# Altium schematic sheet EDVDU_v1.SchDoc
size A0
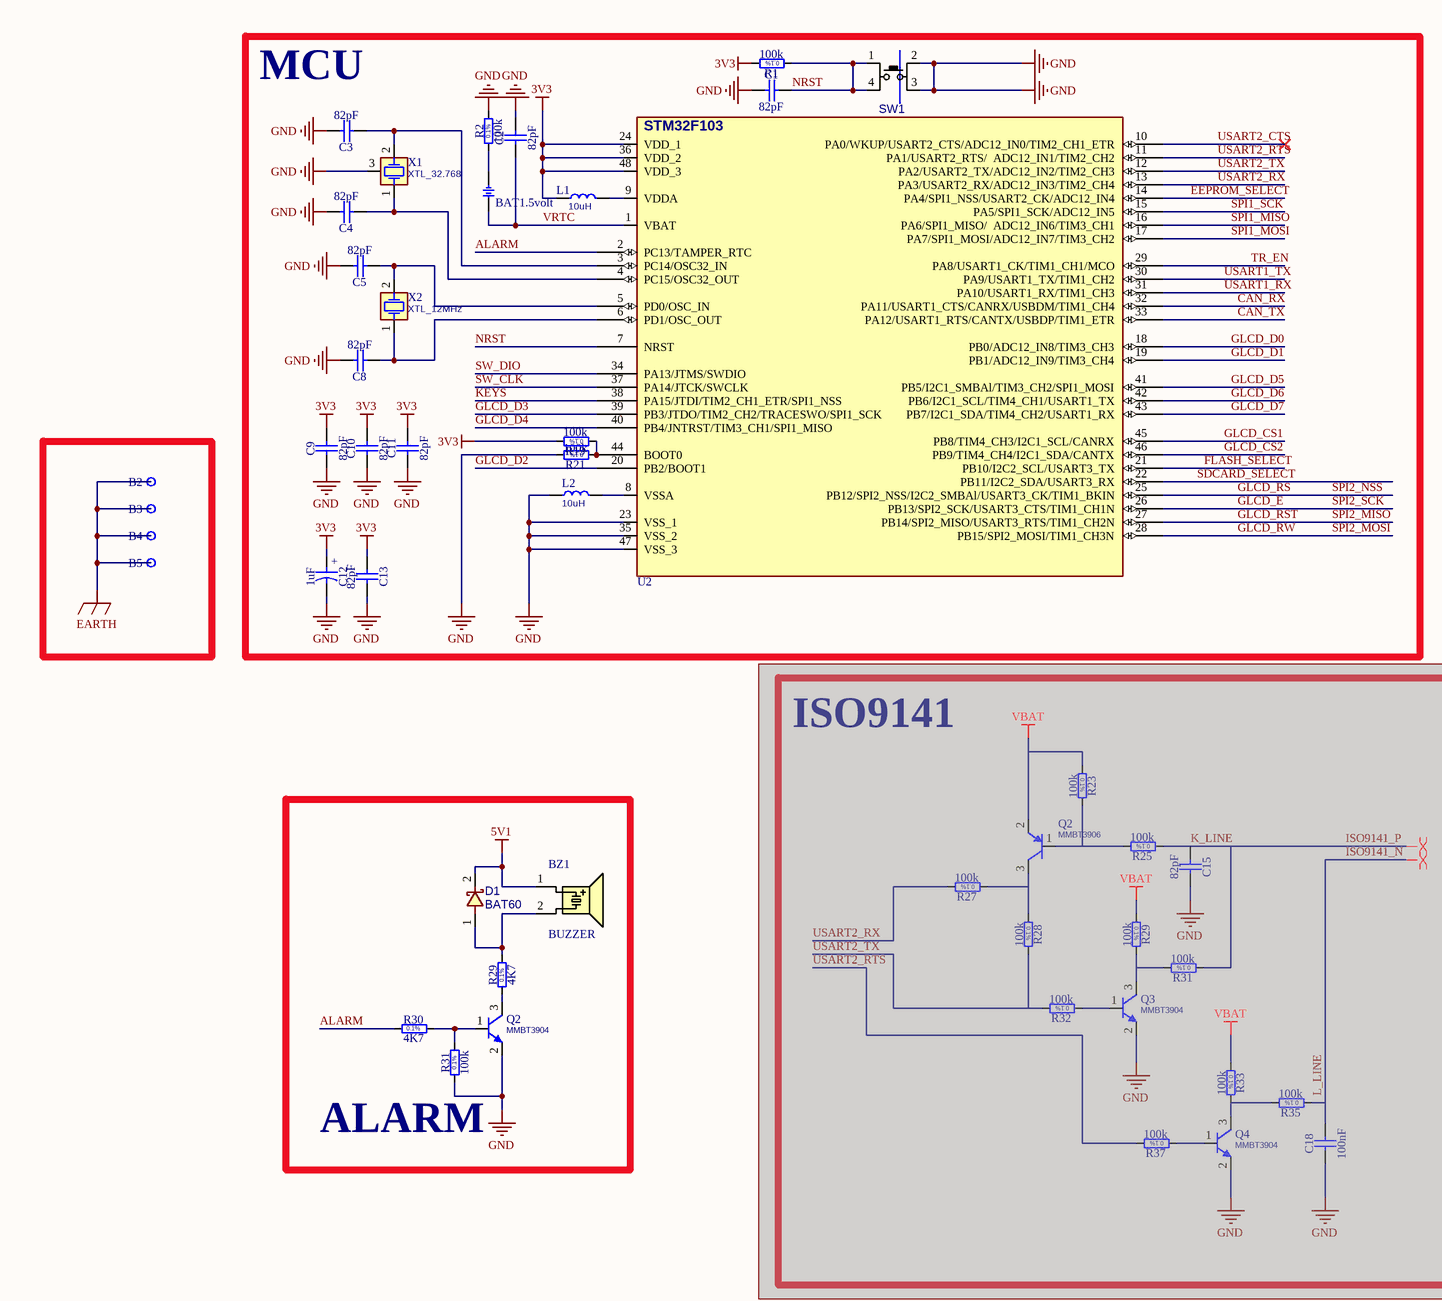
[diagram p0: EDVDU_v1.SchDoc, top left]
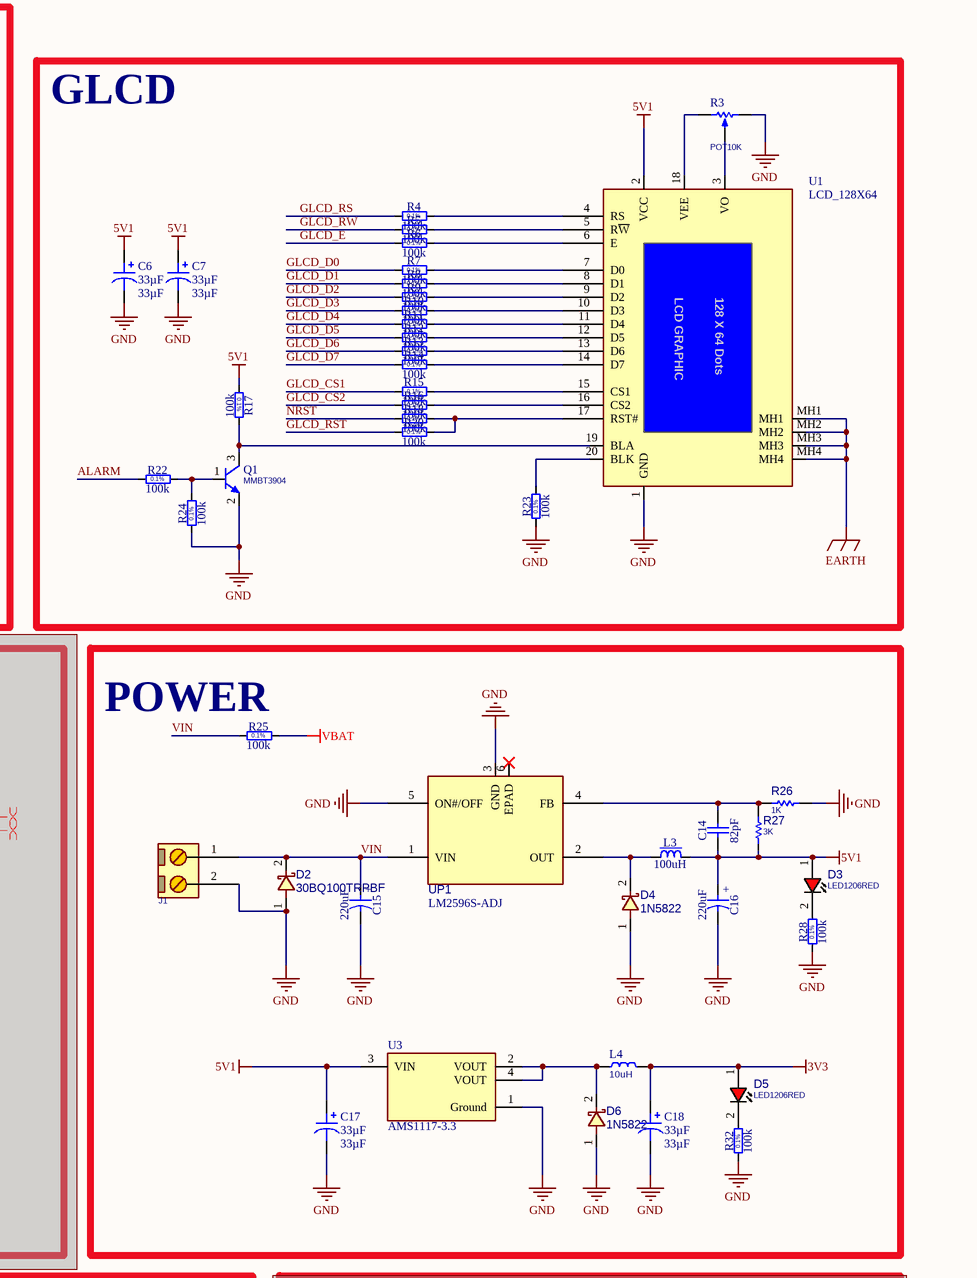
[diagram p1: EDVDU_v1.SchDoc, top right]
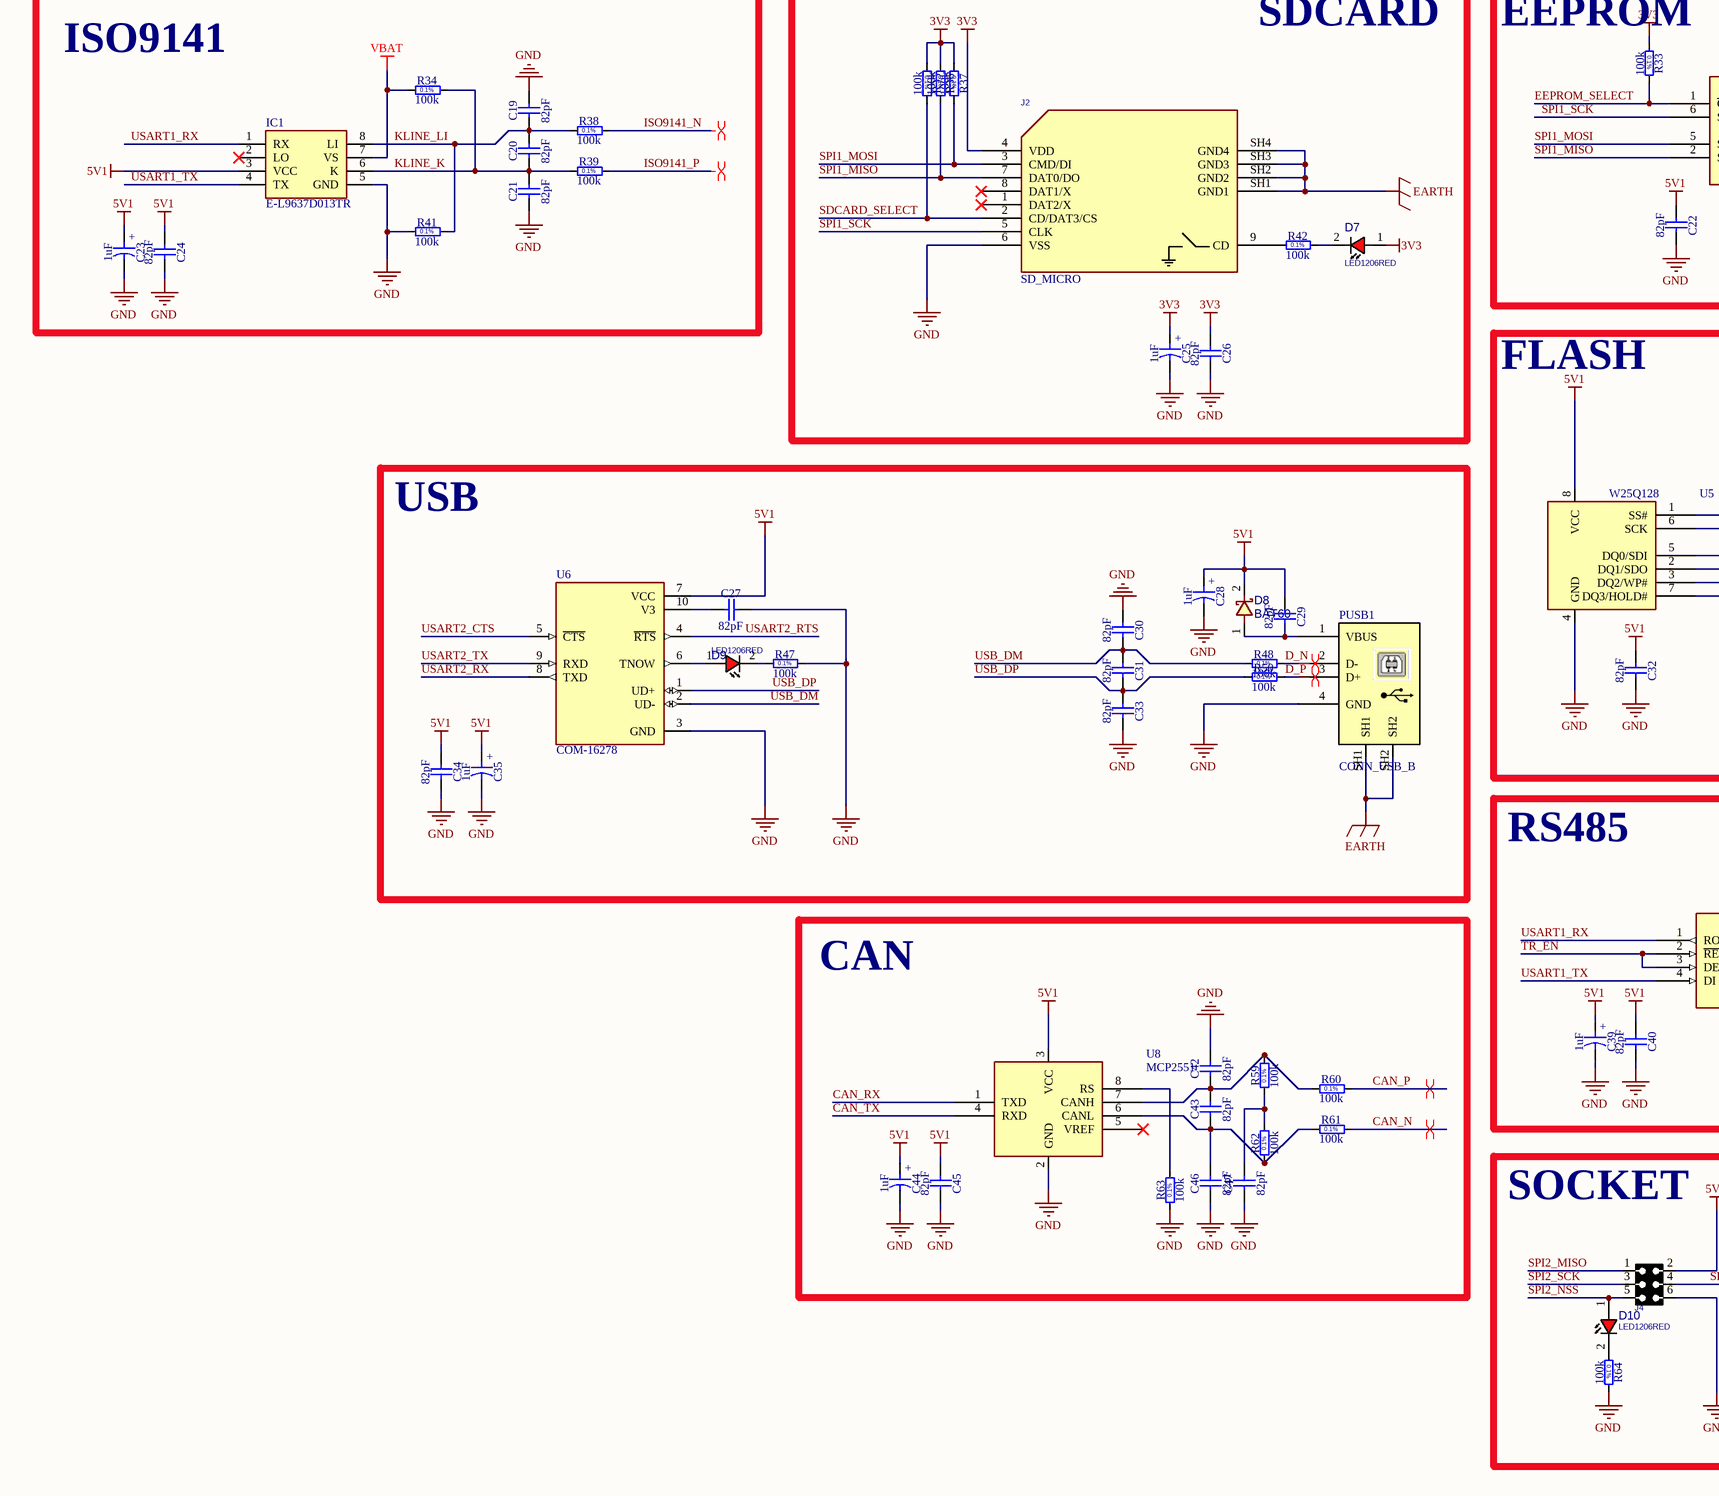
[diagram p2: EDVDU_v1.SchDoc, bottom left]
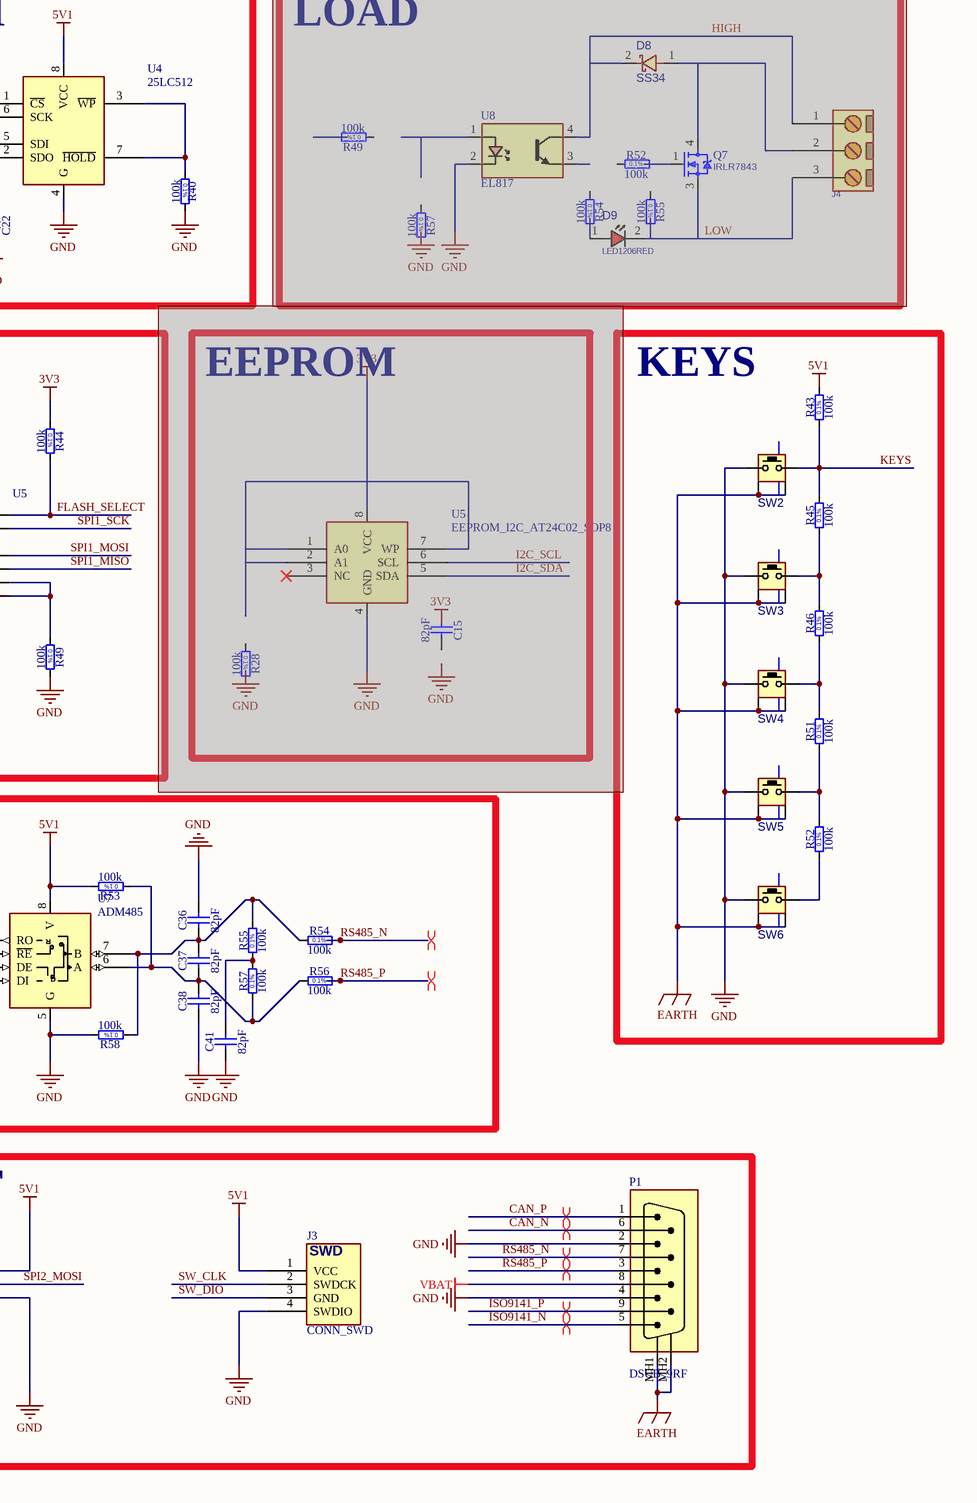
[diagram p3: EDVDU_v1.SchDoc, bottom right]

## Parts
(Parts that share a designator on the sheet are numbered #1, #2 ... from top to bottom, then left to right.)
B1  BAT1.5volt  [BT_TS518FE_FL35E]
B2  Plated Hole  [MTG320_550]  (value not drawn)  (no BOM)
B3  Plated Hole  [MTG320_550]  (value not drawn)  (no BOM)
B4  Plated Hole  [MTG320_550]  (value not drawn)  (no BOM)
B5  Plated Hole  [MTG320_550]  (value not drawn)  (no BOM)
BZ1  BUZZER  [BZ_C12]
C1  82pF  [CAPC3216X140N]
C2  82pF  [CAPC3216X140N]
C3  82pF  [CAPC3216X140N]
C4  82pF  [CAPC3216X140N]
C5  82pF  [CAPC3216X140N]
C6  33µF  [CAP POL 1206_3216]
C7  33µF  [CAP POL 1206_3216]
C8  82pF  [CAPC3216X140N]
C9  82pF  [CAPC3216X140N]
C10  82pF  [CAPC3216X140N]
C11  82pF  [CAPC3216X140N]
C12  1uF  [CAPMP3216X180N]
C13  82pF  [CAPC3216X140N]
C14  82pF  [CAPC3216X140N]
C15#1  82pF  [CAPC3216X140N]  (masked out: inside a compile mask, not in the netlist)
C15#2  220uF  [CAPMP7343X430N]
C15#3  82pF  [CAPC3216X140N]  (masked out: inside a compile mask, not in the netlist)
C16  220uF  [CAPMP7343X430N]
C17  33µF  [CAP POL 1206_3216]
C18#1  33µF  [CAP POL 1206_3216]
C18#2  100nF  [CAPC3216X180N]  (masked out: inside a compile mask, not in the netlist)
C19  82pF  [CAPC3216X140N]
C20  82pF  [CAPC3216X140N]
C21  82pF  [CAPC3216X140N]
C22  82pF  [CAPC3216X140N]
C23  1uF  [CAPMP3216X180N]
C24  82pF  [CAPC3216X140N]
C25  1uF  [CAPMP3216X180N]
C26  82pF  [CAPC3216X140N]
C27  82pF  [CAPC3216X140N]
C28  1uF  [CAPMP3216X180N]
C29  82pF  [CAPC3216X140N]
C30  82pF  [CAPC3216X140N]
C31  82pF  [CAPC3216X140N]
C32  82pF  [CAPC3216X140N]
C33  82pF  [CAPC3216X140N]
C34  82pF  [CAPC3216X140N]
C35  1uF  [CAPMP3216X180N]
C36  82pF  [CAPC3216X140N]
C37  82pF  [CAPC3216X140N]
C38  82pF  [CAPC3216X140N]
C39  1uF  [CAPMP3216X180N]
C40  82pF  [CAPC3216X140N]
C41  82pF  [CAPC3216X140N]
C42  82pF  [CAPC3216X140N]
C43  82pF  [CAPC3216X140N]
C44  1uF  [CAPMP3216X180N]
C45  82pF  [CAPC3216X140N]
C46  82pF  [CAPC3216X140N]
C47  82pF  [CAPC3216X140N]
D1  BAT60  [D_SOD323F]
D2  30BQ100TRPBF  [D_SMC]
D3  LED1206RED  [LED1206RED]
D4  1N5822  [D_SMA]
D5  LED1206RED  [LED1206RED]
D6  1N5822  [D_SMA]
D7  LED1206RED  [LED1206RED]
D8#1  SS34  [D_SMB]  (masked out: inside a compile mask, not in the netlist)
D8#2  BAT60  [D_SOD323F]
D9#1  LED1206RED  [LED1206RED]  (masked out: inside a compile mask, not in the netlist)
D9#2  LED1206RED  [LED1206RED]
D10  LED1206RED  [LED1206RED]
IC1  E-L9637D013TR  [SOIC127P600X175-8N]
J1  POWER  [MSTB_2]  (value not drawn)
J2  value SD_MICRO  [SDMICRO_AT]  (hidden comment: MICROSD)
J3  value CONN_SWD  [WF_4]  (hidden comment: PROG)
J4#1  CONN_MSTB3  [MSTB_3]  (value not drawn)  (masked out: inside a compile mask, not in the netlist)
J4#2  SERIAL  [HDRR_F_2X3]  (value not drawn)
L1  10uH  [L1206]
L2  10uH  [L1206]
L3  100uH  [IND_WURTH_WE-PD_XXL]
L4  10uH  [L1206]
P1  value DSUB_9RF  [DSUB_9RF]  (hidden comment: COMM)
PUSB1  value CONN_USB_B  [USB_B_RA_THD]  (hidden comment: USB)
Q1  MMBT3904  [SOT23_3]
Q2#1  MMBT3906  [SOT23_3]  (masked out: inside a compile mask, not in the netlist)
Q2#2  MMBT3904  [SOT23_3]
Q3  MMBT3904  [SOT23_3]  (masked out: inside a compile mask, not in the netlist)
Q4  MMBT3904  [SOT23_3]  (masked out: inside a compile mask, not in the netlist)
Q7  IRLR7843  [DPAK_3]  (masked out: inside a compile mask, not in the netlist)
R1  100k  [RESC3216X65N]
R2  100k  [RESC3216X65N]
R3  POT10K  [POTS_5MM]
R4  100k  [RESC3216X65N]
R5  100k  [RESC3216X65N]
R6  100k  [RESC3216X65N]
R7  100k  [RESC3216X65N]
R8  100k  [RESC3216X65N]
R9  100k  [RESC3216X65N]
R10  100k  [RESC3216X65N]
R11  100k  [RESC3216X65N]
R12  100k  [RESC3216X65N]
R13  100k  [RESC3216X65N]
R14  100k  [RESC3216X65N]
R15  100k  [RESC3216X65N]
R16  100k  [RESC3216X65N]
R17  100k  [RESC3216X65N]
R18  100k  [RESC3216X65N]
R19  100k  [RESC3216X65N]
R20  100k  [RESC3216X65N]
R21  100k  [RESC3216X65N]
R22  100k  [RESC3216X65N]
R23#1  100k  [RESC3216X65N]
R23#2  100k  [RESC3216X65N]  (masked out: inside a compile mask, not in the netlist)
R24  100k  [RESC3216X65N]
R25#1  100k  [RESC3216X65N]
R25#2  100k  [RESC3216X65N]  (masked out: inside a compile mask, not in the netlist)
R26  1K  [R1206]
R27#1  3K  [R1206]
R27#2  100k  [RESC3216X65N]  (masked out: inside a compile mask, not in the netlist)
R28#1  100k  [RESC3216X65N]  (masked out: inside a compile mask, not in the netlist)
R28#2  100k  [RESC3216X65N]
R28#3  100k  [RESC3216X65N]  (masked out: inside a compile mask, not in the netlist)
R29#1  100k  [RESC3216X65N]  (masked out: inside a compile mask, not in the netlist)
R29#2  4K7  [RES_SEI_HVC1206]
R30  4K7  [RES_SEI_HVC1206]
R31#1  100k  [RESC3216X65N]  (masked out: inside a compile mask, not in the netlist)
R31#2  100k  [RESC3216X65N]
R32#1  100k  [RESC3216X65N]  (masked out: inside a compile mask, not in the netlist)
R32#2  100k  [RESC3216X65N]
R33#1  100k  [RESC3216X65N]  (masked out: inside a compile mask, not in the netlist)
R33#2  100k  [RESC3216X65N]
R34  100k  [RESC3216X65N]
R35#1  100k  [RESC3216X65N]  (masked out: inside a compile mask, not in the netlist)
R35#2  100k  [RESC3216X65N]
R36  100k  [RESC3216X65N]
R37#1  100k  [RESC3216X65N]  (masked out: inside a compile mask, not in the netlist)
R37#2  100k  [RESC3216X65N]
R38  100k  [RESC3216X65N]
R39  100k  [RESC3216X65N]
R40  100k  [RESC3216X65N]
R41  100k  [RESC3216X65N]
R42  100k  [RESC3216X65N]
R43  100k  [RESC3216X65N]
R44  100k  [RESC3216X65N]
R45  100k  [RESC3216X65N]
R46  100k  [RESC3216X65N]
R47  100k  [RESC3216X65N]
R48  100k  [RESC3216X65N]
R49#1  100k  [RESC3216X65N]  (masked out: inside a compile mask, not in the netlist)
R49#2  100k  [RESC3216X65N]
R50  100k  [RESC3216X65N]
R51  100k  [RESC3216X65N]
R52#1  100k  [RESC3216X65N]  (masked out: inside a compile mask, not in the netlist)
R52#2  100k  [RESC3216X65N]
R53  100k  [RESC3216X65N]
R54#1  100k  [RESC3216X65N]  (masked out: inside a compile mask, not in the netlist)
R54#2  100k  [RESC3216X65N]
R55#1  100k  [RESC3216X65N]  (masked out: inside a compile mask, not in the netlist)
R55#2  100k  [RESC3216X65N]
R56  100k  [RESC3216X65N]
R57#1  100k  [RESC3216X65N]  (masked out: inside a compile mask, not in the netlist)
R57#2  100k  [RESC3216X65N]
R58  100k  [RESC3216X65N]
R59  100k  [RESC3216X65N]
R60  100k  [RESC3216X65N]
R61  100k  [RESC3216X65N]
R62  100k  [RESC3216X65N]
R63  100k  [RESC3216X65N]
R64  100k  [RESC3216X65N]
SW1  PUSHBUTTON  [SWPBS_SPDT_6X6X5]  (value not drawn)
SW2  RIGHT  [SWPBT_SPST_R_6X6X6]  (value not drawn)
SW3  LEFT  [SWPBT_SPST_R_6X6X6]  (value not drawn)
SW4  UP  [SWPBT_SPST_R_6X6X6]  (value not drawn)
SW5  GO  [SWPBT_SPST_R_6X6X6]  (value not drawn)
SW6  DOWN  [SWPBT_SPST_R_6X6X6]  (value not drawn)
U1  LCD_128X64  [LCDG_128X64_BLU]
U2  STM32F103  [QFG50_48]  (value not drawn)
U3  AMS1117-3.3  [FP-AMS1117-IPC_B]
U4  25LC512  [SO_8]
U5#1  W25Q128  [SO_8_W]
U5#2  EEPROM_I2C_AT24C02_SOP8  [SO_8]  (masked out: inside a compile mask, not in the netlist)
U6  COM-16278  [SOP50P490X120-10N]
U7  ADM485  [SO_8]
U8#1  EL817  [DIP_4SMD]  (masked out: inside a compile mask, not in the netlist)
U8#2  MCP2551  [SO_8]
UP1  LM2596S-ADJ  [D2PAK_5]
X1  XTL_32.768  [XTL_RTC]
X2  XTL_12MHz  [XTL_2_11X5]

## Blocks framed on the sheet
MCU: B1 C1-C5 C8-C13 L1 L2 R1 R2 R19 R21 SW1 U2 X1 X2
GLCD: C6 C7 Q1 R3-R18 R20 R22 R23#1 R24 U1
ISO9141: C15#1 C18#2 Q2#1 Q3 Q4 R23#2 R25#2 R27#2 R28#1 R29#1 R31#1 R32#1 R33#1 R35#1 R37#1
POWER: C14 C15#2 C16 C17 C18#1 D2-D6 J1 L3 L4 R25#1 R26 R27#1 R28#2 R32#2 U3 UP1
ALARM: BZ1 D1 Q2#2 R29#2 R30 R31#2
ISO9141: C19-C21 C23 C24 IC1 R34 R38 R39 R41
SDCARD: C25 C26 D7 J2 R35#2 R36 R37#2 R42
EEPROM: C22 R33#2 R40 U4
LOAD: D8#1 D9#1 J4#1 Q7 R49#1 R52#1 R54#1 R55#1 R57#1 U8#1
FLASH: C32 R44 R49#2 U5#1
EEPROM: C15#3 R28#3 U5#2
KEYS: R43 R45 R46 R51 R52#2 SW2-SW6
USB: C27-C31 C33-C35 D8#2 D9#2 PUSB1 R47 R48 R50 U6
RS485: C36-C41 R53 R54#2 R55#2 R56 R57#2 R58 U7
CAN: C42-C47 R59-R63 U8#2
SOCKET: D10 J3 J4#2 P1 R64

## Nets
3V3: C9.2 C10.2 C11.2 C12.1 C13.2 C18#1.1 C25.1 C26.2 D5.1(ANODE) D7.1(ANODE) J2.4(VDD) L1.1 L4.2 R1.2 R19.2 R33#2.1 R35#2.1 R36.1 R37#2.1 R44.1 U2.24(VDD_1) U2.36(VDD_2) U2.48(VDD_3)
5V1: BZ1.1(A) C6.1 C7.1 C14.1 C16.1 C17.1 C22.2 C23.1 C24.2 C28.1 C29.1 C32.2 C34.2 C35.1 C39.1 C40.2 C44.1 C45.2 D1.2 D3.1(ANODE) D8#2.2 IC1.3(VCC) J3.1(VCC) J4#2.2 L3.2 R17.1 R27#1.1 R43.2 R53.2 U1.2(VCC) U3.3(VIN) U4.8(VCC) U5#1.8(VCC) U6.7(VCC) U7.8(V) U8#2.3(VCC)
EARTH: B2.1 B3.1 B4.1 B5.1 J2.SH1(GND1) J2.SH2(GND2) J2.SH3(GND3) J2.SH4(GND4) P1.MH1 P1.MH2 PUSB1.SH1 PUSB1.SH2 SW2.MH1 SW2.MH2 SW3.MH1 SW3.MH2 SW4.MH1 SW4.MH2 SW5.MH1 SW5.MH2 SW6.MH1 SW6.MH2 U1.MH1 U1.MH2 U1.MH3 U1.MH4
GND: C1.1 C2.2 C3.2 C4.2 C5.2 C6.2 C7.2 C8.2 C9.1 C10.1 C11.1 C12.2 C13.1 C15#2.2 C16.2 C17.2 C18#1.2 C19.1 C21.2 C22.1 C23.2 C24.1 C25.2 C26.1 C27.2 C28.2 C30.1 C32.1 C33.2 C34.1 C35.2 C36.1 C38.2 C39.2 C40.1 C41.2 C42.1 C44.2 C45.1 C46.2 C47.2 D2.1 D4.1 D6.1 IC1.5(GND) J1.2 J2.6(VSS) J3.4(SWDIO) J4#2.6 L2.1 P1.2 P1.4 PUSB1.4(GND) Q1.2(E) Q2#2.2(E) R2.2 R3.3(BOT) R21.2 R23#1.1 R24.1 R26.1 R28#2.1 R31#2.1 R32#2.1 R40.2 R41.1 R47.1 R49#2.2 R58.2 R63.1 R64.1 SW1.2(P3) SW1.3(P4) SW2.1 SW3.1 SW4.1 SW5.1 SW6.1 U1.1(GND) U2.23(VSS_1) U2.35(VSS_2) U2.47(VSS_3) U3.1(Ground) U4.4(G) U5#1.4(GND) U6.3(GND) U7.5(G) U8#2.2(GND) UP1.3(GND) UP1.5(ON#/OFF) X1.3(CASE)
VBAT: IC1.7(VS) P1.8 R25#1.2 R34.1
ALARM: R22.1 R30.1 U2.2(PC13/TAMPER_RTC)
CAN_N: P1.6 R61.2
CAN_P: P1.1 R60.2
CAN_RX: U2.32(PA11/USART1_CTS/CANRX/USBDM/TIM1_CH4) U8#2.1(TXD)
CAN_TX: U2.33(PA12/USART1_RTS/CANTX/USBDP/TIM1_ETR) U8#2.4(RXD)
D_N: PUSB1.2(D-) R48.2
D_P: PUSB1.3(D+) R50.2
EEPROM_SELECT: R33#2.2 U2.14(PA4/SPI1_NSS/USART2_CK/ADC12_IN4) U4.1(~{CS})
FLASH_SELECT: R44.2 U2.21(PB10/I2C2_SCL/USART3_TX) U5#1.1(SS#)
GLCD_CS1: R15.1 U2.45(PB8/TIM4_CH3/I2C1_SCL/CANRX)
GLCD_CS2: R16.1 U2.46(PB9/TIM4_CH4/I2C1_SDA/CANTX)
GLCD_D0: R7.1 U2.18(PB0/ADC12_IN8/TIM3_CH3)
GLCD_D1: R8.1 U2.19(PB1/ADC12_IN9/TIM3_CH4)
GLCD_D2: R9.1 U2.20(PB2/BOOT1)
GLCD_D3: R10.1 U2.39(PB3/JTDO/TIM2_CH2/TRACESWO/SPI1_SCK)
GLCD_D4: R11.1 U2.40(PB4/JNTRST/TIM3_CH1/SPI1_MISO)
GLCD_D5: R12.1 U2.41(PB5/I2C1_SMBAl/TIM3_CH2/SPI1_MOSI)
GLCD_D6: R13.1 U2.42(PB6/I2C1_SCL/TIM4_CH1/USART1_TX)
GLCD_D7: R14.1 U2.43(PB7/I2C1_SDA/TIM4_CH2/USART1_RX)
GLCD_E: J4#2.3 R6.1 U2.26(PB13/SPI2_SCK/USART3_CTS/TIM1_CH1N)  [also labelled SPI2_SCK]
GLCD_RS: D10.1(ANODE) J4#2.5 R4.1 U2.25(PB12/SPI2_NSS/I2C2_SMBAl/USART3_CK/TIM1_BKIN)  [also labelled SPI2_NSS]
GLCD_RST: J4#2.1 R20.1 U2.27(PB14/SPI2_MISO/USART3_RTS/TIM1_CH2N)  [also labelled SPI2_MISO]
GLCD_RW: J4#2.4 R5.1 U2.28(PB15/SPI2_MOSI/TIM1_CH3N)  [also labelled SPI2_MOSI]
ISO9141_N: P1.5 R38.2
ISO9141_P: P1.9 R39.2
KEYS: R43.1 R45.2 SW2.2 U2.38(PA15/JTDI/TIM2_CH1_ETR/SPI1_NSS)
KLINE_K: C20.2 C21.1 IC1.6(K) R34.2 R39.1
KLINE_LI: C19.2 C20.1 IC1.8(LI) R38.1 R41.2
NRST: C1.2 R1.1 R18.1 SW1.1(P1) SW1.4(P2) U2.7(NRST)
RS485_N: P1.7 R54#2.2
RS485_P: P1.3 R56.2
SDCARD_SELECT: J2.2(CD/DAT3/CS) R35#2.2 U2.22(PB11/I2C2_SDA/USART3_RX)
SPI1_MISO: J2.7(DAT0/DO) R36.2 U2.16(PA6/SPI1_MISO/__ADC12_IN6/TIM3_CH1) U4.2(SDO) U5#1.2(DQ1/SDO)
SPI1_MOSI: J2.3(CMD/DI) R37#2.2 U2.17(PA7/SPI1_MOSI/ADC12_IN7/TIM3_CH2) U4.5(SDI) U5#1.5(DQ0/SDI)
SPI1_SCK: J2.5(CLK) U2.15(PA5/SPI1_SCK/ADC12_IN5) U4.6(SCK) U5#1.6(SCK)
SW_CLK: J3.2(SWDCK) U2.37(PA14/JTCK/SWCLK)
SW_DIO: J3.3(GND) U2.34(PA13/JTMS/SWDIO)
TR_EN: U2.29(PA8/USART1_CK/TIM1_CH1/MCO) U7.2(~{RE}) U7.3(DE)
USART1_RX: IC1.1(RX) U2.31(PA10/USART1_RX/TIM1_CH3) U7.1(RO)
USART1_TX: IC1.4(TX) U2.30(PA9/USART1_TX/TIM1_CH2) U7.4(DI)
USART2_CTS: U2.10(PA0/WKUP/USART2_CTS/ADC12_IN0/TIM2_CH1_ETR) U6.5(~{CTS})
USART2_RTS: U2.11(PA1/USART2_RTS/__ADC12_IN1/TIM2_CH2) U6.4(~{RTS})
USART2_RX: U2.13(PA3/USART2_RX/ADC12_IN3/TIM2_CH4) U6.8(TXD)
USART2_TX: U2.12(PA2/USART2_TX/ADC12_IN2/TIM2_CH3) U6.9(RXD)
USB_DM: C30.2 C31.1 R48.1 U6.2(UD-)
USB_DP: C31.2 C33.1 R50.1 U6.1(UD+)
VIN: C15#2.1 D2.2 J1.1 R25#1.1 UP1.1(VIN)
VRTC: B1.1 C2.1 U2.1(VBAT)
NetB1_2: B1.2 R2.1
NetBZ1_2: BZ1.2(B) D1.1 R29#2.2
NetC3_1: C3.1 U2.3(PC14/OSC32_IN) X1.2(OSC2)
NetC4_1: C4.1 U2.4(PC15/OSC32_OUT) X1.1(OSC1)
NetC5_1: C5.1 U2.5(PD0/OSC_IN) X2.2(OSC2)
NetC8_1: C8.1 U2.6(PD1/OSC_OUT) X2.1(OSC1)
NetC14_2: C14.2 R26.2 R27#1.2 UP1.4(FB)
NetC27_1: C27.1 U6.10(V3)
NetC29_2: C29.2 D8#2.1 PUSB1.1(VBUS)
NetC36_2: C36.2 C37.1 R54#2.1 R55#2.2 R58.1 U7.7(B)
NetC37_2: C37.2 C38.1 R53.1 R56.1 R57#2.1 U7.6(A)
NetC41_1: C41.1 R55#2.1 R57#2.2
NetC42_2: C42.2 C43.1 R59.2 R60.1 U8#2.7(CANH)
NetC43_2: C43.2 C46.1 R61.1 R62.1 U8#2.6(CANL)
NetC47_1: C47.1 R59.1 R62.2
NetD3_2: D3.2(CATHODE) R28#2.2
NetD4_2: D4.2 L3.1 UP1.2(OUT)
NetD5_2: D5.2(CATHODE) R32#2.2
NetD6_2: D6.2 L4.1 U3.2(VOUT) U3.4(VOUT)
NetD7_2: D7.2(CATHODE) R42.2
NetD9#2_1: D9#2.1(ANODE) U6.6(TNOW)
NetD9#2_2: D9#2.2(CATHODE) R47.2
NetD10_2: D10.2(CATHODE) R64.2
NetJ2_9: J2.9(CD) R42.1
NetL1_2: L1.2 U2.9(VDDA)
NetL2_2: L2.2 U2.8(VSSA)
NetQ1_1: Q1.1(B) R22.2 R24.2
NetQ1_3: Q1.3(C) R17.2 U1.19(BLA)
NetQ2#2_1: Q2#2.1(B) R30.2 R31#2.2
NetQ2#2_3: Q2#2.3(C) R29#2.1
NetR3_1: R3.1(TOP) U1.18(VEE)
NetR3_2: R3.2(TAP) U1.3(VO)
NetR4_2: R4.2 U1.4(RS)
NetR5_2: R5.2 U1.5(R~{W})
NetR6_2: R6.2 U1.6(E)
NetR7_2: R7.2 U1.7(D0)
NetR8_2: R8.2 U1.8(D1)
NetR9_2: R9.2 U1.9(D2)
NetR10_2: R10.2 U1.10(D3)
NetR11_2: R11.2 U1.11(D4)
NetR12_2: R12.2 U1.12(D5)
NetR13_2: R13.2 U1.13(D6)
NetR14_2: R14.2 U1.14(D7)
NetR15_2: R15.2 U1.15(CS1)
NetR16_2: R16.2 U1.16(CS2)
NetR18_2: R18.2 R20.2 U1.17(RST#)
NetR19_1: R19.1 R21.1 U2.44(BOOT0)
NetR23#1_2: R23#1.2 U1.20(BLK)
NetR40_1: R40.1 U4.3(~{WP}) U4.7(~{HOLD})
NetR45_1: R45.1 R46.2 SW3.2
NetR46_1: R46.1 R51.2 SW4.2
NetR49#2_1: R49#2.1 U5#1.3(DQ2/WP#) U5#1.7(DQ3/HOLD#)
NetR51_1: R51.1 R52#2.2 SW5.2
NetR52#2_1: R52#2.1 SW6.2
NetR63_2: R63.2 U8#2.8(RS)

Not connected (* = marked no-connect by the designer): IC1 2(LO)*; J2 1(DAT2/X)* 8(DAT1/X)*; U8#2 5(VREF)*; UP1 6(EPAD)*

## Layout directives
differential pair: (no net found under the mark), CAN_N, CAN_P, D_N, D_P, ISO9141_N, ISO9141_P, RS485_N, RS485_P

## Notes on the sheet
- (in symbol ADM485_SOP8) R; D
- (in symbol CONN_SWD) SWD
- (in symbol CTE3216-18_1UF_16V_10%) +
- (in symbol CTE7343-43_47UF_35V_10%) +
- (in symbol LCDG_128X64_BLU) LCD GRAPHIC; 128 X 64 Dots
- (in symbol R1206_10M_0.1%_0.33W_25PPM_SEI_HVC) 0.1%
- (in symbol R1206_100K_0.1%_0.25W_25PPM) 0.1%

## Library data of the parts
B1 = BATT_MS518SE: BATTERY HOLDER, MS518SE TS518FE; MANF_P#: MS518SE-FL35E; MANF_P#2: TS518FE-FL35E; MANF: SEIKO; VALUE: BAT1.5volt
B2-B5 = PLATED_HOLE3.2_PAD5.5: Single Terminal Socket; Part Description: Plated Through Hole: Hole Dia.=3.2mm Pad Dia.=5.5mm; Mounted: No; Part Number: PLATED_HOLE3.2_PAD5.5; Component Type: Standard (No BOM); Pin Count: 1; Family: Plated Hole; Socket: No; SMD: No; Sense: No; Status: None; ComponentHeight: 0mm; HelpURL: Undefined; Author: CERN DEM JMW; CreateDate: 10/1/2012; LatestRevisionDate: 10/1/2012; PackageDescription: Plated Through Hole: Hole Dia.=3.2mm Pad Dia.=5.5mm
BZ1 = BUZZER_C12: Buzzer, 12X8.5mm, Magnetic Transducer; MANF: Buerklin, CUI; MANF_P#: CM12P, MT03-H1BHP, BMT1205XH7.5, CEM-1201(50); PARAM: 2048 ±200 Hz; PRICE: PRICE; VALUE: BUZZER
C1-C5 C8-C11 C13 C14 C15#1 C15#3 C19-C22 C24 C26 C27 C29-C34 C36-C38 C40-C43 C45-C47 = CC1206_82PF_50V_5%_NP0: Non-polarised capacitor; Part Description: SMD Multilayer Chip Ceramic Capacitor; Manufacturer: GENERIC; Manufacturer1 Part Number: VJ1206A820JXAAT; Voltage: 50V; TC: C0G/NP0; Tolerance: ±5%; Value: 82pF; Part Number: CC1206_82PF_50V_5%_NP0; Component Kind: Standard; Component Type: Standard; Pin Count: 2; Status: Preferred; Manufacturer Part Number: CC1206_82PF_50V_5%_NP0; Case: 1206; Mounted: Yes; Socket: No; SMD: Yes; Sense: No; Manufacturer1 Example: VISHAY VITRAMON; Manufacturer1 ComponentHeight: 1.7mm; HelpURL: \\cern.ch\dfs\Applications\Altium\Datasheets\CC1206_NP0_VISHAY_VJ.pdf; Author: CERN DEM JLC; CreateDate: 12/3/2007; LatestRevisionDate: 12/3/2007
C6 C7 C17 C18#1 = T527I336M010ATE200: CAP TANT POLY 33UF 10V 1206; Part Number: T527I336M010ATE200; Value: 33µF
C12 C23 C25 C28 C35 C39 C44 = CTE3216-18_1UF_16V_10%: Polarised capacitor; Part Description: Solid Tantalum Chip Capacitor; Manufacturer: GENERIC; Manufacturer1 Part Number: TAJA105K016RNJ; Voltage: 16V; Tolerance: ±10%; Value: 1uF; Part Number: CTE3216-18_1UF_16V_10%; Component Kind: Standard; Component Type: Standard; Pin Count: 2; Status: Preferred; Manufacturer Part Number: CTE3216-18_1UF_16V_10%; Case: A; Mounted: Yes; Socket: No; SMD: Yes; Sense: No; Manufacturer1 Example: AVX; Manufacturer1 ComponentHeight: 1.8mm; HelpURL: \\cern.ch\dfs\Applications\Altium\Datasheets\CTE_AVX_TAJ.pdf; Author: CERN DEM JLC; CreateDate: 9/3/2012; LatestRevisionDate: 9/3/2012
C15#2 C16 = CTE7343-43_47UF_35V_10%: Polarised capacitor; Part Description: Solid Tantalum Chip Capacitor; Manufacturer: GENERIC; Manufacturer1 Part Number: TAJE476K035R; Value: 47uF; Voltage: 35V; Tolerance: ±10%; Part Number: CTE7343-43_47UF_35V_10%; Component Kind: Standard; Component Type: Standard; Pin Count: 2; Status: Preferred; Manufacturer Part Number: CTE7343-43_47UF_35V_10%; Case: E; Mounted: Yes; Socket: No; SMD: Yes; Sense: No; Manufacturer1 Example: AVX; Manufacturer1 ComponentHeight: 4.3mm; HelpURL: \\cern.ch\dfs\Applications\Altium\Datasheets\CTE_AVX_TAJ.pdf; Author: CERN DEM JLC; CreateDate: 12/3/2007; LatestRevisionDate: 12/3/2007
C18#2 = CC1206_56PF_2KV_5%_C0G: Non-polarised capacitor; Part Description: High Voltage MLC Chip Capacitor; Manufacturer: GENERIC; Manufacturer1 Part Number: 1206GA560JAT2A; Value: 56pF; Voltage: 2kV; TC: C0G/NP0; Tolerance: ±5%; Part Number: CC1206_56PF_2KV_5%_C0G; Component Kind: Standard; Component Type: Standard; Pin Count: 2; Status: None; Manufacturer Part Number: CC1206_56PF_2KV_5%_C0G; Case: 1206; Mounted: Yes; Socket: No; SMD: Yes; Sense: No; Manufacturer1 Example: AVX; Manufacturer1 ComponentHeight: 1.8mm; HelpURL: \\cern.ch\dfs\Applications\Altium\Datasheets\CC1206_C0G_AVX_HV-MLC.pdf; Author: CERN DEM JLC; CreateDate: 5/17/2017; LatestRevisionDate: 5/17/2017
D1 D8#2 = DIODE_SMD_SCHOTTKY_BAT60: DIODE, SCHOTTKY, 10V, 3A, 0.3Vf; MANF: Infineon; MANF_P#: BAT60AE6327HTSA1; DESC: DESCRIPTION; PARAM2: VFdrop: 0.1V@10mA, 0.22V@1A; PARAM: 3A, 1.35W, -55~85oC; ASSEMBLY: ASSEMBLY; PRICE: 0.4$; VALUE: BAT60
D2 = DIODE_SMD_SCHOTTKY_30BQ100TRPBF: DIODE, SCHOTTKY, 100V, 3A; MANF: Vishay; DESC: DESCRIPTION; MANF_P#: 30BQ100TRPBF; ASSEMBLY: ASSEMBLY; PRICE: PRICE; PARAM2: 3A; PARAM: 100V; VALUE: 30BQ100TRPBF
D3 D5 D7 D9#1 D9#2 D10 = LED_SMD_1206_RED: LED, SMD, 1206, RED; DESC: DESCRIPTION; MANF_P#: MANF_PART#; PARAM2: 2.2V; MANF: MANF; ASSEMBLY: ASSEMBLY; PRICE: 36t@Javan; VALUE: LED1206RED
D4 D6 = DIODE_SMD_SCHOTTKY_1N5822: DIODE, SCHOTTKY, 40V, 3A; MANF: DIODES; DESC: DESCRIPTION; MANF_P#: 1N5822; ASSEMBLY: ASSEMBLY; PRICE: PRICE; PARAM2: 3A; PARAM: 40V; VALUE: 1N5822
D8#1 = DIODE_SMD_SCHOTTKY_SS34: DIODE, SCHOTTKY, 20V, 3A; MANF: VISHAY; DESC: DESCRIPTION; MANF_P#: SS34; ASSEMBLY: ASSEMBLY; PRICE: PRICE; PARAM2: 3A; PARAM: 20V; VALUE: SS34
IC1 = E-L9637D013TR: Integrated Circuit; Manufacturer_Name: STMicroelectronics; Datasheet Link: http://www.st.com/web/en/resource/technical/document/datasheet/CD00000234.pdf; Height: 1.75mm; Manufacturer_Part_Number: E-L9637D013TR; Mouser Part Number: 511-E-L9637D013TR; Mouser Price/Stock: https://www.mouser.co.uk/ProductDetail/STMicroelectronics/E-L9637D013TR?qs=lrqjml%252Bjt8c%252BkvHgz14nAg%3D%3D; Arrow Part Number: E-L9637D013TR; Arrow Price/Stock: https://www.arrow.com/en/products/e-l9637d013tr/stmicroelectronics?region=nac
J1 = CONN_MSTB_2: CONN, PHOENIX MSTB 2.5/2-GF-5.08; VALUE: CONN_MSTB2; MANF_P#: MSTB 2.5/2-GF-5.08
J2 = SOCKET_SDMICRO_AT: SD MICRO exist in Iran, Attend 112J-TDAR-R01; PARAM: push-push; MANF: Attend; MANF_P#: 112J-TDAR-R01
J3 = CONN_SWD: CONN, SWD, ST
J4#1 = CONN_MSTB_3: CONN, PHOENIX MSTB 2.5/3-GF-5.08; VALUE: CONN_MSTB3; MANF_P#: MSTB 2.5/3-GF-5.08
J4#2 = HDRR_F_2X3: CONN, HEADER, RightAngle, Female, pitch: 2.54mm, 6POS; MANF_P#: MANF_PART#; VALUE: HDRF_2X3; MANF: MANF
L1 L2 L4 = IND_SMD: IND, SMD; VALUE: 10uH
L3 = IND_100UH_20%_WURTH_WE-PD_7447709101: Inductor With Core; Part Description: Power-Choke Inductor (WE-PD Series); Manufacturer: WURTH ELEKTRONIK; Power: 2.5A; Resistance: 0.1R; Tolerance: ±20%; Part Number: IND_100UH_20%_WURTH_WE-PD_7447709101; Component Kind: Standard; Component Type: Standard; Pin Count: 2; Value: 100uH; Status: None; Manufacturer Part Number: 7447709101; Mounted: Yes; Socket: No; SMD: Yes; Sense: No; ComponentHeight: 10mm; HelpURL: \\cern.ch\dfs\Applications\Altium\Datasheets\IND_WURTH_WE-PD_7447709101.pdf; Author: CERN DEM JLC; CreateDate: 3/15/2012; LatestRevisionDate: 3/15/2012
P1 = CONN_DSUB_9RF: CONN, DSUB, HD, 9PIN, R/A, FEMALE, THD; MANF_P#: -; MANF: -
PUSB1 = CONN_USB_B_RA_THD: CONN, USB, B, R/A, THD; MANF_P#: 292304-1; MANF: TE Connectivity
Q1 Q2#2 Q3 Q4 = NPN_MMBT3904_SOT23: BJT, NPN, 40v, 0.2A, SMD, SOT23; PARAM2: 250mW; MANF: Diodes, NXP, FAIRCHILD, ON; PARAM: 40v, 0.2A; MANF_P#: MMBT3904; VALUE: MMBT3904
Q2#1 = PNP_MMBT3906_SOT23: BJT, PNP, 40v, 0.2A, SMD, SOT23; PARAM2: 250mW; MANF: Diodes, NXP, FAIRCHILD, ON; PARAM: 40v, 0.2A; MANF_P#: MMBT3906; VALUE: MMBT3906
Q7 = MOSN_IRLR7843_DPAK: HEXFET Power MOSFET; ASSEMBLY: ASSEMBLY; MANF_P#: IRLR7843; VALUE: IRLR7843
R1 R2 R4-R22 R23#1 R23#2 R24 R25#1 R25#2 R27#2 R28#1-R28#3 R29#1 R31#1 R31#2 R32#1 R32#2 R33#1 R33#2 R34 R35#1 R35#2 R36 R37#1 R37#2 R38-R48 R49#1 R49#2 R50 R51 R52#1 R52#2 R53 R54#1 R54#2 R55#1 R55#2 R56 R57#1 R57#2 R58-R64 = R1206_100K_0.1%_0.25W_25PPM: Resistor - 0.1%; Part Description: Thin Film Chip Resistor; Manufacturer: GENERIC; Manufacturer1 Part Number: RN73H2BTTD1003B25; Power: 0.25W; TC: ±25ppm/°C; PressFit: No; Value: 100k; Part Number: R1206_100K_0.1%_0.25W_25PPM; Component Kind: Standard; Component Type: Standard; Pin Count: 2; Status: Not Recommended; Tolerance: ±0.1%; Manufacturer Part Number: R1206_100K_0.1%_0.25W_25PPM; Case: 1206; Mounted: Yes; Sense: No; Socket: No; SMD: Yes; Manufacturer1 Example: KOA; Manufacturer1 ComponentHeight: 0.70mm; HelpURL: \\cern.ch\dfs\Applications\Altium\Datasheets\R1206_KOA_RN73H.pdf; Author: CERN DEM JLC; CreateDate: 12/3/2007; LatestRevisionDate: 3/13/2008
R3 = RES_SMD_POT_5MM: RESISTOR, SMD, Potentiometer, 5mm; VALUE: POT10K
R26 R27#1 = RES_SMD: RES, SMD; MANF_P#: RK73H1ETTP4701F; MANF: KOA SPEER; PARAM: 0.063W; DESC: DESCRIPTION; DIST#: MOUSER; PARAM2: 1%; ASSEMBLY: ASSEMBLY; PRICE: 100= 0.5$
  R26: VALUE: 1K
  R27#1: VALUE: 3K
R29#2 R30 = R1206_10M_0.1%_0.33W_25PPM_SEI_HVC: Resistor - 0.1%; Part Description: High Voltage Thick Film Chip Resistor; Manufacturer: SEI (STACKPOLE ELECTRONICS INC.); Manufacturer Part Number: HVCB1206BDE10M0; Value: 10M; Power: 0.33W; TC: ±25ppm/°C; Voltage: 1500V; Tolerance: ±1%; PressFit: No; Part Number: R1206_10M_0.1%_0.33W_25PPM_SEI_HVC; Component Kind: Standard; Component Type: Standard; Pin Count: 2; Status: None; Case: 1206; Mounted: Yes; Sense: No; Socket: No; SMD: Yes; ComponentHeight: 0.65mm; HelpURL: \\cern.ch\dfs\Applications\Altium\Datasheets\R1206_SEI_HVC.pdf; Author: CERN DEM JLC; CreateDate: 10/4/2017; LatestRevisionDate: 10/4/2017
SW1 = SWPBS_SPDT_6X6X5_TL3301: SWITCH, PUSH BUTTON, TACTILE, SMD, SPDT, 6X6X5mm; MANF: ESWITCH; DESC: DESCRIPTION; MANF_P#: TL3301EF100QG; VALUE: PUSHBUTTON; ASSEMBLY: ASSEMBLY; PARAM: PARAM; PRICE: PRICE
SW2-SW6 = SWPBT_SPST_R_6X6X6_SKHHLUA010: SWITCH, PUSH BUTTON, TACTILE, THD, SPST, 6X6X6mm RIGHT; MANF: ALPS; DESC: DESCRIPTION; VALUE: PUSHBUTTON; ASSEMBLY: ASSEMBLY; PARAM: PARAM; PRICE: PRICE; MANF_P#: SKHHLUA010
U1 = LCDG_128X64_BLU: LCD Graphic Disp, 128X64, with KS108 Controller; MANF_P#: TS12864A-2, LCD12864A, GDM12864A; PARAM2: Green back, Gray, 5V; PARAM: 128X64 Dots, 2.9"; MANF: -; VALUE: LCD_128X64
U2 = STM32F103C8T6_QFP48: MCU, STM32 ARM 32-bit, Cortex M3, 64KB FLASH, 20KB SRAM; DESC: CAN, I2C, SPI, USART, USB; MANF: ST; PARAM2: 2~3.6VCC, 72MHz, 2X12Bit ADC; PARAM: 64KB FLASH, 20KB SRAM, -40~85oC; MANF_P#: STM32F103C8T6; PRICE: 6$; VALUE: STM32F103
U3 = CMP-209535-000001-1: LDO Voltage Regulators 1A, 3.3V; Manufacturer: Advanced Monolithic Systems; Dropout Voltage: 1.1V; Output Type: Fixed; Nominal Supply Current: 5mA; Max Power Dissipation: 1.2W; Max Supply Voltage: 15V; Number Of Outputs: 1; Standoff Height: 0.64mm; Max Junction Temp: +125°C; Height: 1.8mm; Package: AMS1117; Device Class L2: Power Management ICs; ComponentLink2Description: Datasheet; ComponentLink2URL: http://www.advanced-monolithic.com/pdf/ds1117.pdf; Category: IC; RoHS: TRUE; Automotive: No; Device Class L1: Integrated Circuits (ICs); Output Current: 1A; Device Class L3: Voltage Regulators - Linear; Temperature: -40°C to +125°C; Output Voltage: 3.3V; Manufacturer Part Number: AMS1117-3.3; Temperature Range Low: -40°C; Octopart: https://octopart.com/ams1117-3.3-advanced+monolithic+systems-25899300; Lead Free: Yes; Ipc Land Pattern Name: SOT229P700X180-4; Temperature Range High: +125°C
U4 = EEPROM_SPI_25LC512_SOP8: EEPROM, SPI, 512kbit (64K x8), SOP-8; MANF: Microchip; MANF_P#: 25LC512-E/SN; PARAM2: 2.5~5.5V, 200Year, 20MHz; PARAM: 512kbit (64K x8), -40~125oC; PRICE: 2$; VALUE: 25LC512
U5#1 = W25Q128_SO8W: SPI FLASH Memory, 128Mb (16M x8), 104MHz; MANF: WINBOND; MANF_P#: W25Q128FVSIG; PARAM2: 2.7~3.6V; PARAM: 128Mb (16M x8), 104MHz; PRICE: 1.6$; VALUE: W25Q128
U5#2 = EEPROM_I2C_AT24C02_SOP8: EEPROM, I2C; VALUE: AT24C02
U6 = COM-16278: SparkFun Accessories USB to Serial IC - CH340E (10 Pack); MP: COM-16278; Purchase-URL: https://pricing.snapeda.com/search/part/COM-16278/?ref=eda; Price: None; SnapEDA_Link: https://www.snapeda.com/parts/COM-16278/SparkFun/view-part/?ref=snap; Check_prices: https://www.snapeda.com/parts/COM-16278/SparkFun/view-part/?ref=eda; Package: None; MF: SparkFun; Availability: In Stock; Value: *
U7 = ADM485_SOP8: RS485 Transceiver, 5V, SOP-8, ±7V Ground Difference Between Devices on the Bus; MANF_P#: ADM485AR; MANF: Analog Devices; PRICE: 4000toman@PAYA; VALUE: ADM485
U8#1 = OPTC_TR4P_EL817_SMD: OPTOCOUPLER, TRANSISTOR, 4PIN; PARAM: IF=5mA; PARAM2: VCE = 5V; PRICE: 300t@Paya; VALUE: EL817
U8#2 = MCP2551_SOP8: Can, Transceiver, High Speed, 5V (VDD); MANF: MICROCHIP; MANF_P#: MCP2551-I/SN; PARAM2: 5V (VDD), 12/24V; PRICE: 3000toman@PAYA; PARAM: PARAM; VALUE: MCP2551
UP1 = VREG_LM2596S-ADJ: REG, Switching, Buck, 3A, ADJ, 150KHz, TO-263; MANF: TI, ON, TS; PARAM: 3A, ADJ; PARAM2: 50KHz, 40VIN; ASSEMBLY: ASSEMBLY; PRICE: PRICE; DESC: REG, Switching, Buck, 3A, ADJ, 150KHz, TO-263; MANF_P#: LM2596S-ADJ; VALUE: LM2596S-ADJ
X1 = XTL_3_32.768_SMD: Crystal MOST POPULAR PACKAGE; MANF: ABRACON; MANF_P#: AB26T-32.768KHZ; PARAM2: 12pF; PARAM: 20PPM, -40~85°C; VALUE: XTL_32.768
X2 = XTL_2_HC49_SMD: Crystal MOST POPULAR ABL HC49 PACKAGE; VALUE: XTL_12MHz